# EAGLE schematic Sensor_Gyro_ITG-3701_I2C_0b1101000 (EAGLE 6.5.0)
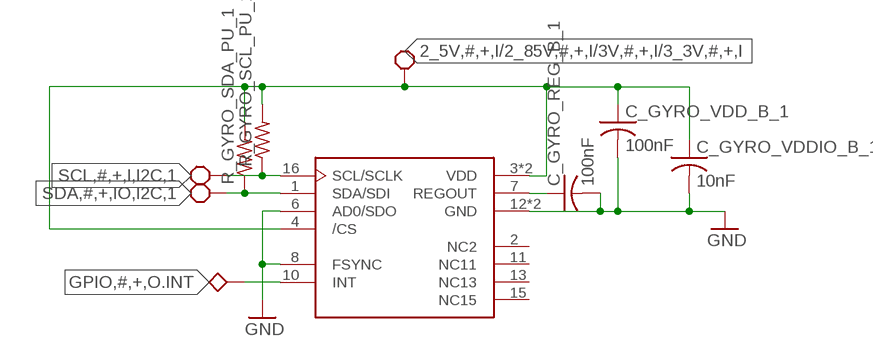
[diagram p0: schematic, sheet 1]

## Parts
C_GYRO_REG_B_1  100nF  C-USC0402  [C0402]
C_GYRO_VDD_B_1  100nF  C-USC0402  [C0402]
C_GYRO_VDDIO_B_1  10nF  C-USC0402  [C0402]
R_GYRO_SCL_PU_1  R-US_R0402  [R0402]
R_GYRO_SDA_PU_1  R-US_R0402  [R0402]
U$1  ITG-3701  [QFN16-3X3]

## Nets
2_5V,#,+,I/2_85V,#,+,I/3V,#,+,I/3_3V,#,+,I: C_GYRO_VDD_B_1.1 C_GYRO_VDDIO_B_1.1 R_GYRO_SCL_PU_1.2 R_GYRO_SDA_PU_1.2 U$1.3(VDD) U$1.4(/CS) U$1.9(VDD) ; supply symbol labelled BLOCK_REQUIREMENT
GND: C_GYRO_REG_B_1.2 C_GYRO_VDD_B_1.2 C_GYRO_VDDIO_B_1.2 U$1.6(AD0/SDO) U$1.8(FSYNC) U$1.12(GND) U$1.14(GND)
GPIO,#,+,O.INT: U$1.10(INT) ; supply symbol labelled BLOCK_RECOMMENDED
N$3: C_GYRO_REG_B_1.1 U$1.7(REGOUT)
SCL,#,+,I,I2C,1: R_GYRO_SCL_PU_1.1 U$1.16(SCL/SCLK) ; supply symbol labelled BLOCK_REQUIREMENT
SDA,#,+,IO,I2C,1: R_GYRO_SDA_PU_1.1 U$1.1(SDA/SDI) ; supply symbol labelled BLOCK_REQUIREMENT
Unconnected: U$1.2(NC2) U$1.11(NC11) U$1.13(NC13) U$1.15(NC15)

## Library data of the parts
C_GYRO_REG_B_1 C_GYRO_VDD_B_1 C_GYRO_VDDIO_B_1 = resistor:C-US: CAPACITOR, American symbol
R_GYRO_SCL_PU_1 R_GYRO_SDA_PU_1 = resistor:R-US_: RESISTOR, American symbol
U$1 = block_parts:ITG-3701: InvenSense ITG-3701 ITG-3701 Low Power 3 Axis Gyro with an improved full scale range Status: Standard Datasheet: ITG-3701 DataSheet </datasheets/invensense/PS-ITG-3701.pdf> RoHS Compliance: Yes Specifications: Part Status: NEW Axis: (X/Y/Z) Full Scale Ranges: +1000, +2000, +4000, +500 ±°sec Operating Voltage Supply: 1.71V–3.5V V Gyro Full Scale Range: ±250 ±500 ±1000 ±2000 +4000 °/sec Gyro Sensitivity: 131 65.5 32.8 16.4 LSB/°/sec Digital Output: I²C or SPI Logic Supply Voltage: 1.71 to VDD V Package Size: 3x3x0.9 mm Also Available... Part Function Part Number Description Evaluation Board ITG-3701EVB <http://store.invensense.com/ProductDetail/ITG3701EVB-InvenSense-Inc/517612/> InvenSense Inc. Evaluation board for the ITG-3701 Evaluation Board EMSENSR-ITG3701 <http://store.invensense.com/ProductDetail/EMSENSRITG3701-Embedded-Masters/519165/> Embedded Masters Evaluation Board for the InvenSense ITG-3701 Motion Sensor